# Altium schematic sheet OZ440-SE100-CAR003_sheet13.SchDoc
size A3
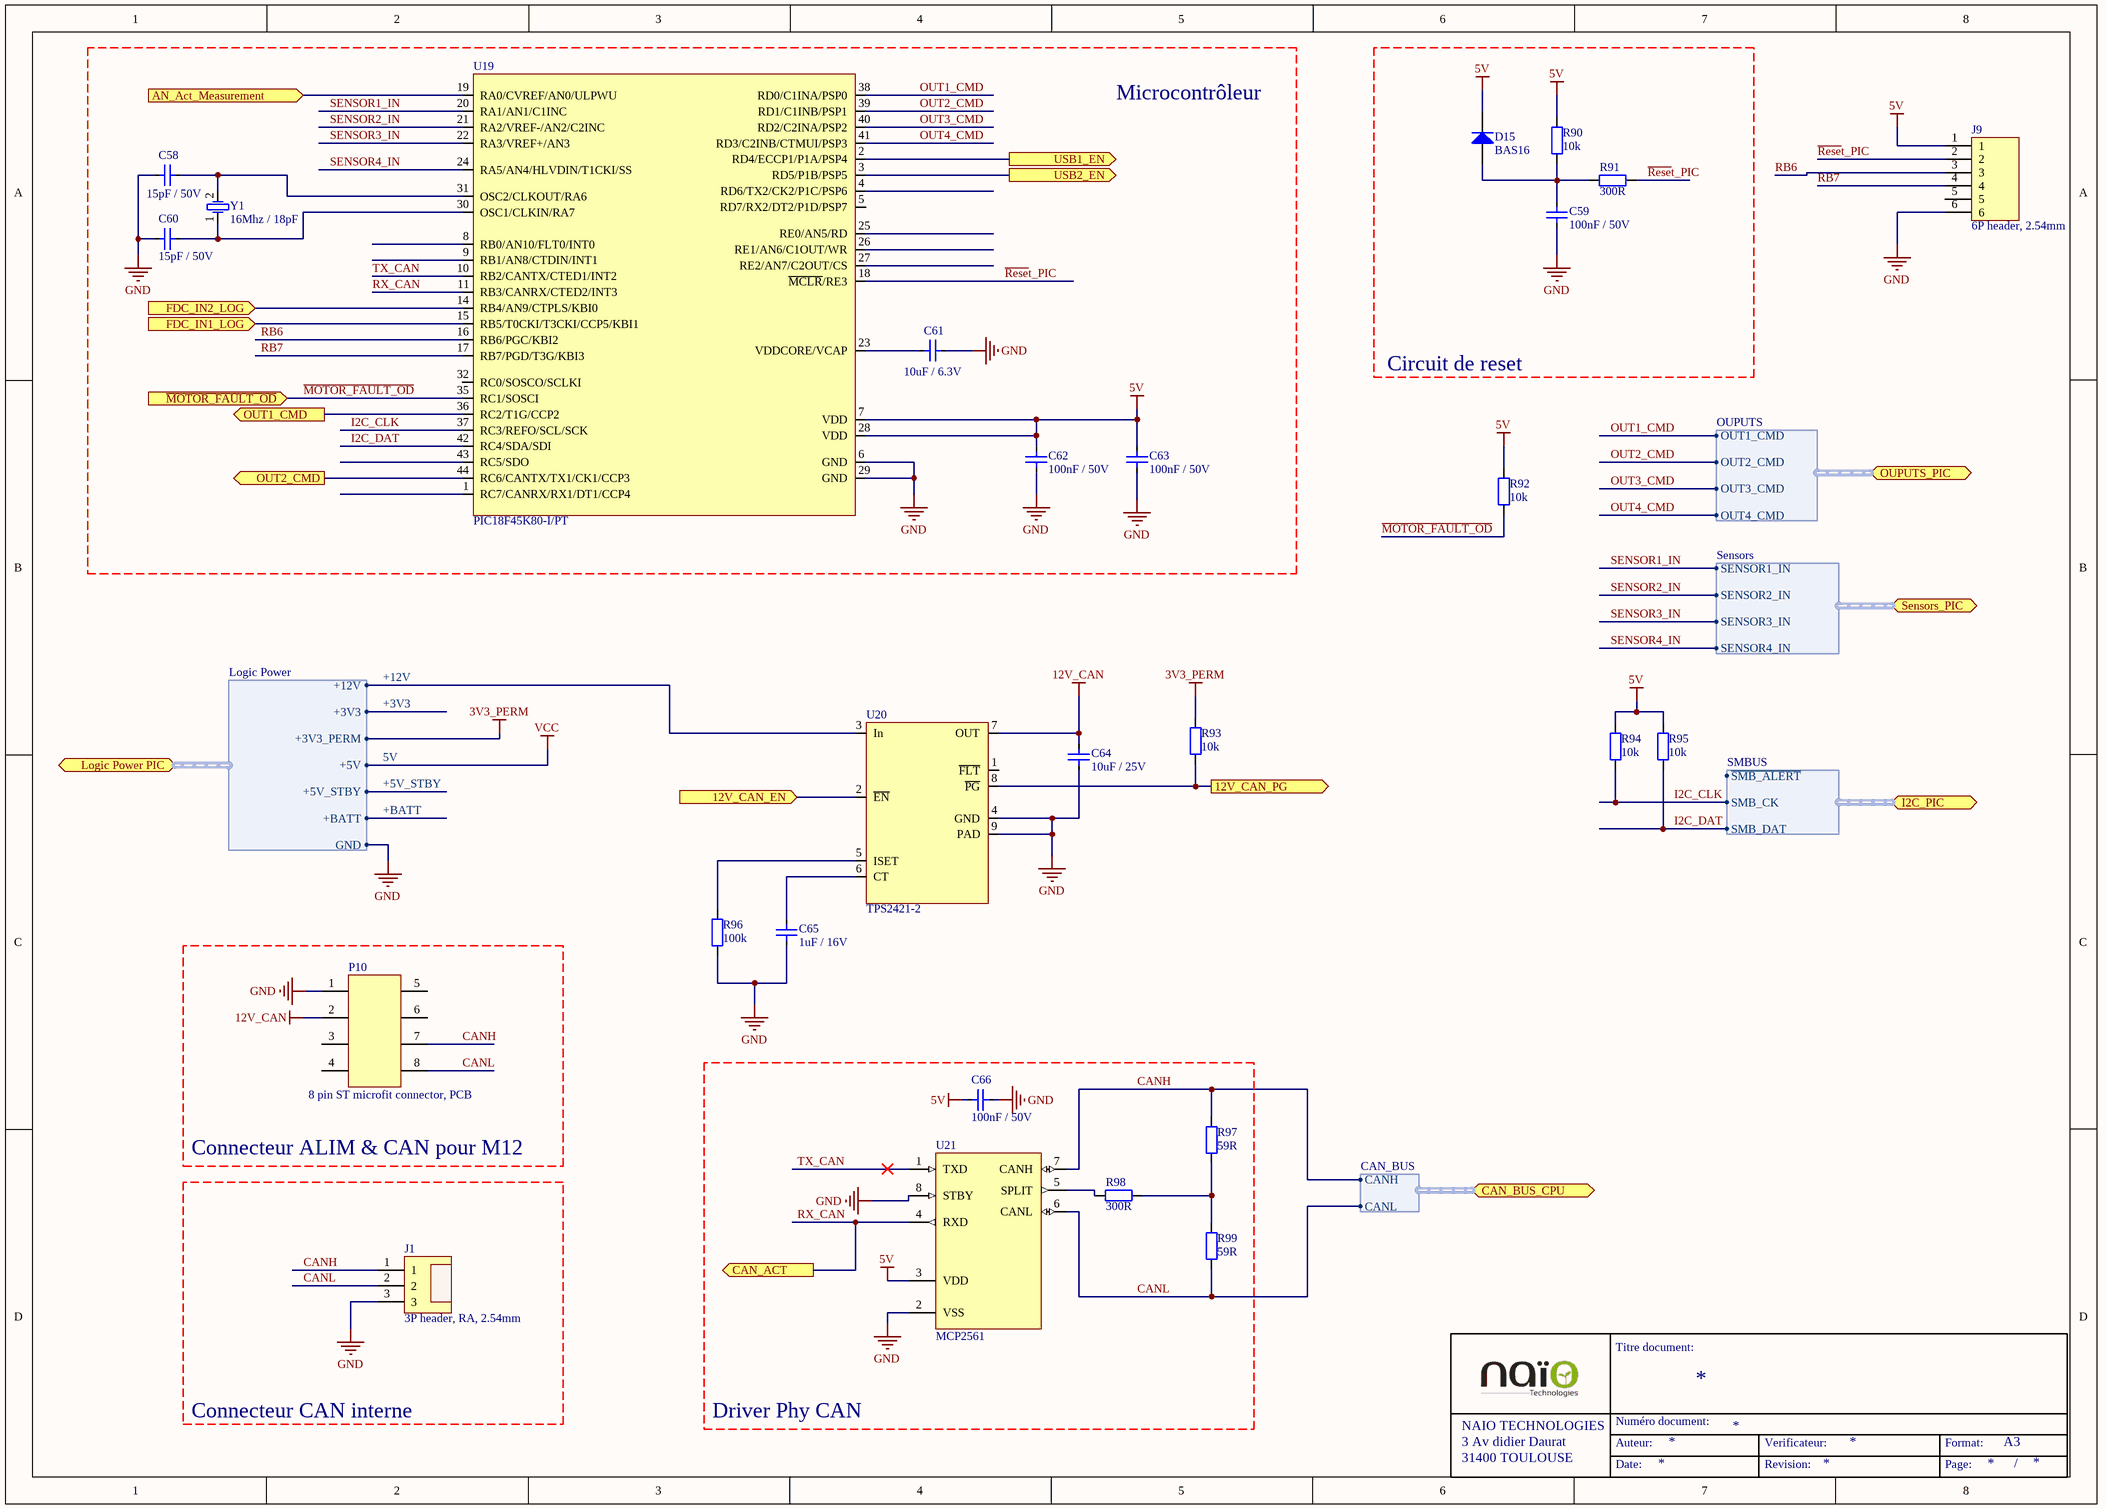
[diagram p0: OZ440-SE100-CAR003_sheet13.SchDoc]

## Parts
C58  Displayed reference: 15pF / 50V  [C0805-STD]  (hidden comment: CAP-SMD)
C59  Displayed reference: 100nF / 50V  [C0805-STD]  (hidden comment: CAP-SMD)
C60  Displayed reference: 15pF / 50V  [C0805-STD]  (hidden comment: CAP-SMD)
C61  Displayed reference: 10uF / 6.3V  [C0805-STD]  (hidden comment: CAP-SMD)
C62  Displayed reference: 100nF / 50V  [C0805-STD]  (hidden comment: CAP-SMD)
C63  Displayed reference: 100nF / 50V  [C0805-STD]  (hidden comment: CAP-SMD)
C64  Displayed reference: 10uF / 25V  [C1206-STD]  (hidden comment: CAP-SMD)
C65  Displayed reference: 1uF / 16V  [C0805-STD]  (hidden comment: CAP-SMD)
C66  Displayed reference: 100nF / 50V  [C0805-STD]  (hidden comment: CAP-SMD)
D15  Displayed reference: BAS16  [SOT23-STD]  (hidden comment: BAS16-SOT23)
J1  Displayed reference: 3P header, RA, 2.54mm  [CONN-SPE_MOLEX_0015913033]  (hidden comment: CONN-STD-3P_1ROW)
J9  Displayed reference: 6P header, 2.54mm  [6P_HEADER-STD_TH_1ROW]  (hidden comment: CONN-STD-6P_1ROW)
P10  Displayed reference: 8 pin ST microfit connector, PCB  [CONN-SPE_MOLEX_43045-0812]  (hidden comment: CONN-SPE-8P_MOLEX_43045-0801)
R90  Displayed reference: 10k  [R0805-STD]  (hidden comment: RES-SMD)
R91  Displayed reference: 300R  [R0805-STD]  (hidden comment: RES-SMD)
R92  Displayed reference: 10k  [R0805-STD]  (hidden comment: RES-SMD)
R93  Displayed reference: 10k  [R0805-STD]  (hidden comment: RES-SMD)
R94  Displayed reference: 10k  [R0805-STD]  (hidden comment: RES-SMD)
R95  Displayed reference: 10k  [R0805-STD]  (hidden comment: RES-SMD)
R96  Displayed reference: 100k  [R0805-STD]  (hidden comment: RES-SMD)
R97  Displayed reference: 59R  [R0805-STD]  (hidden comment: RES-SMD)
R98  Displayed reference: 300R  [R0805-STD]  (hidden comment: RES-SMD)
R99  Displayed reference: 59R  [R0805-STD]  (hidden comment: RES-SMD)
U19  Displayed reference: PIC18F45K80-I/PT  [TQFP44-SPE-PIC18F45k80]  (hidden comment: P18F45K80-TQFP44)
U20  Displayed reference: TPS2421-2  [SO8_THERMAL-STD]  (hidden comment: TPS2421-SO8)
U21  Displayed reference: MCP2561  [SO8-SPE-MCP2561]  (hidden comment: MCP2561-SOIC08)
Y1  Displayed reference: 16Mhz / 18pF  [XTAL-SPE-HC49_SMD]  (hidden comment: XTAL-SMD)

## Ports
12V_CAN_EN (in), 12V_CAN_PG (out), AN_Act_Measurement (in), CAN_ACT (out), CAN_BUS_CPU (harness CAN_BUS), FDC_IN1_LOG (in), FDC_IN2_LOG (in), I2C_PIC (harness SMBUS), Logic Power PIC (harness Logic Power), OUPUTS_PIC (harness OUPUTS), OUT1_CMD (out), OUT2_CMD (out), Sensors_PIC (harness Sensors), USB1_EN (out), USB2_EN (out), ~{MOTOR_FAULT_OD} (in)

## Harnesses
CAN_BUS: CANH, CANL
Logic Power: +12V, +3V3, +3V3_PERM, +5V, +5V_STBY, +BATT, GND
OUPUTS: OUT1_CMD, OUT2_CMD, OUT3_CMD, OUT4_CMD
Sensors: SENSOR1_IN, SENSOR2_IN, SENSOR3_IN, SENSOR4_IN
SMBUS: ~{SMB_ALERT}, SMB_CK, SMB_DAT

## Nets
3V3_PERM: R93.1 ; port Logic Power PIC.+3V3_PERM
5V: C62.2 C63.2 C66.2 D15.3(K) J9.1 R90.2 R92.2 R94.2 R95.2 U19.7(VDD) U19.28(VDD) U21.3(VDD) ; port Logic Power PIC.+5V  [also labelled VCC]
12V_CAN: C64.2 P10.2 U20.7(OUT)
GND: C58.1 C59.1 C60.1 C61.2 C62.1 C63.1 C64.1 C65.1 C66.1 J1.3 J9.6 P10.1 R96.1 U19.6(GND) U19.29(GND) U20.4(GND) U20.9(PAD) U21.2(VSS) U21.8(STBY) ; port Logic Power PIC.GND
12V_CAN_EN: U20.2(~{EN}) ; port 12V_CAN_EN
12V_CAN_PG: R93.2 U20.8(~{PG}) ; port 12V_CAN_PG
+3V3: port Logic Power PIC.+3V3
+5V_STBY: port Logic Power PIC.+5V_STBY
+12V: U20.3(In) ; port Logic Power PIC.+12V
+BATT: port Logic Power PIC.+BATT
~{MOTOR_FAULT_OD}: R92.1 U19.35(RC1/SOSCI) ; port ~{MOTOR_FAULT_OD}
~{Rese}t_PIC: J9.2 R91.2 U19.18(~{MCLR}/RE3)
AN_Act_Measurement: U19.19(RA0/CVREF/AN0/ULPWU) ; port AN_Act_Measurement
CANH: J1.1 P10.7 R97.2 U21.7(CANH) ; port CAN_BUS_CPU.CANH
CANL: J1.2 P10.8 R99.1 U21.6(CANL) ; port CAN_BUS_CPU.CANL
FDC_IN1_LOG: U19.15(RB5/T0CKI/T3CKI/CCP5/KBI1) ; port FDC_IN1_LOG
FDC_IN2_LOG: U19.14(RB4/AN9/CTPLS/KBI0) ; port FDC_IN2_LOG
I2C_CLK: R94.1 U19.37(RC3/REFO/SCL/SCK) ; port I2C_PIC.SMB_CK
I2C_DAT: R95.1 U19.42(RC4/SDA/SDI) ; port I2C_PIC.SMB_DAT
OUT1_CMD: U19.36(RC2/T1G/CCP2) ; port OUT1_CMD
OUT1_CMD: U19.38(RD0/C1INA/PSP0) ; port OUPUTS_PIC.OUT1_CMD  [a separate net that carries the same name]
OUT2_CMD: U19.44(RC6/CANTX/TX1/CK1/CCP3) ; port OUT2_CMD
OUT2_CMD: U19.39(RD1/C1INB/PSP1) ; port OUPUTS_PIC.OUT2_CMD  [a separate net that carries the same name]
OUT3_CMD: U19.40(RD2/C2INA/PSP2) ; port OUPUTS_PIC.OUT3_CMD
OUT4_CMD: U19.41(RD3/C2INB/CTMUI/PSP3) ; port OUPUTS_PIC.OUT4_CMD
RB6: J9.3 U19.16(RB6/PGC/KBI2)
RB7: J9.4 U19.17(RB7/PGD/T3G/KBI3)
RX_CAN: U19.11(RB3/CANRX/CTED2/INT3) U21.4(RXD) ; port CAN_ACT
SENSOR1_IN: U19.20(RA1/AN1/C1INC) ; port Sensors_PIC.SENSOR1_IN
SENSOR2_IN: U19.21(RA2/VREF-/AN2/C2INC) ; port Sensors_PIC.SENSOR2_IN
SENSOR3_IN: U19.22(RA3/VREF+/AN3) ; port Sensors_PIC.SENSOR3_IN
SENSOR4_IN: U19.24(RA5/AN4/HLVDIN/T1CKI/SS) ; port Sensors_PIC.SENSOR4_IN
TX_CAN: U19.10(RB2/CANTX/CTED1/INT2) U21.1(TXD)
USB1_EN: U19.2(RD4/ECCP1/P1A/PSP4) ; port USB1_EN
USB2_EN: U19.3(RD5/P1B/PSP5) ; port USB2_EN
NetC58_2: C58.2 U19.31(OSC2/CLKOUT/RA6) Y1.2(OSC2)
NetC59_2: C59.2 D15.1(A) R90.1 R91.1
NetC60_2: C60.2 U19.30(OSC1/CLKIN/RA7) Y1.1(OSC1)
NetC61_1: C61.1 U19.23(VDDCORE/VCAP)
NetC65_2: C65.2 U20.6(CT)
NetR96_2: R96.2 U20.5(ISET)
NetR97_1: R97.1 R98.2 R99.2
NetR98_1: R98.1 U21.5(SPLIT)

Not connected (* = marked no-connect by the designer): J9 5; P10 3 4(7) 5(9) 6; U19 1(RC7/CANRX/RX1/DT1/CCP4) 4(RD6/TX2/CK2/P1C/PSP6) 5(RD7/RX2/DT2/P1D/PSP7) 8(RB0/AN10/FLT0/INT0) 9(RB1/AN8/CTDIN/INT1) 25(RE0/AN5/RD) 26(RE1/AN6/C1OUT/WR) 27(RE2/AN7/C2OUT/CS) 32(RC0/SOSCO/SCLKI) 43(RC5/SDO); U20 1(~{FLT})

## Notes on the sheet
- Microcontrôleur
- Circuit de reset
- Connecteur ALIM & CAN pour M12
- Connecteur CAN interne
- Driver Phy CAN
- Titre document:
- NAIO TECHNOLOGIES
- 3 Av didier Daurat
- 31400 TOULOUSE
- Auteur:
- Numéro document:
- Verificateur:
- Format:
- A3
- Date:
- Revision:
- Page:
- /

## Library data of the parts
C58 C60 = C0805C150J5GACxx: 0805 15pF / 50V COG ceramic capacitor; Manufacturer: Kemet; Max Voltage: 50; Tolerance: +/- 5%; Validated: N; Reference: C0805C150J5GACxx; Value: 15pF; Material: COG; Footprint description: standard Capacitor 0805; Pin Count: 2; helpURL: http://www.farnell.com/datasheets/40863.pdf; Supplier 1: Farnell; Supplier Part Number 1: 1650868; Supplier 2: Digi-Key; Supplier Part Number 2: 399-1111-1-ND
C59 C62 C63 C66 = VJ0805Y104KXAxx: 0805 100nF / 50V  X7R ceramic capacitor; Manufacturer: vishay; Max Voltage: 50; Tolerance: +/- 10%; Validated: N; Reference: VJ0805Y104KXAxx; Value: 100nF; Material: X7R; Footprint description: standard Capacitor 0805; Pin Count: 2; helpURL: http://www.vishay.com/docs/45200/highrels.pdf; Supplier 1: Farnell; Supplier Part Number 1: 1612208; Supplier 2: Digi-Key; Supplier Part Number 2: 720-1266-6-ND
C61 = C0805C106K9PACxx: 0805 10uF / 6.3V X5R ceramic capacitor; Manufacturer: Kemet; Max Voltage: 6.3; Tolerance: +/- 10%; Validated: N; Reference: C0805C106K9PACxx; Value: 10uF; Material: X5R; Footprint description: standard Capacitor 0805; Pin Count: 2; helpURL: http://www.farnell.com/datasheets/40863.pdf; Supplier 1: Farnell; Supplier Part Number 1: 1643357; Supplier 2: Digi-Key; Supplier Part Number 2: 399-3138-1-ND
C64 = C1206C106K3RACxx: 1206 10uF / 25V X7R ceramic capacitor; Manufacturer: Kemet; Max Voltage: 25; Tolerance: +/- 10%; Validated: N; Reference: C1206C106K3RACxx; Value: 10uF; Material: X7R; Footprint description: standard Capacitor 1206; Pin Count: 2; helpURL: http://www.farnell.com/datasheets/1444528.pdf; Supplier 1: Farnell; Supplier Part Number 1: 2118134; Supplier 2: Digi-Key; Supplier Part Number 2: 399-7442-1-ND
C65 = C0805C105K4RACxx: 0805 1uF / 16V X7R ceramic capacitor; Manufacturer: Kemet; Max Voltage: 16; Tolerance: +/- 10%; Validated: N; Reference: C0805C105K4RACxx; Value: 1uF; Material: X7R; Footprint description: standard Capacitor 0805; Pin Count: 2; helpURL: http://www.farnell.com/datasheets/40863.pdf; Supplier 1: Farnell; Supplier Part Number 1: 9227792; Supplier 2: Digi-Key; Supplier Part Number 2: 399-6930-1-ND
D15 = BAS16: 100V / 120mA signal  diode; Manufacturer: NXP; Max Voltage: 100; Max Current: 0.2A; Validated: False; Reference: BAS16; component type: DIODE; Footprint description: Sot23 SMD package; Pin Count: 3; Rev: 2010; helpURL: http://www.nxp.com/documents/data_sheet/BAS16_SER.pdf; Supplier 1: Farnell; Supplier Part Number 1: 1081180; Supplier 2: Digi-Key; Supplier Part Number 2: 568-1596-1-ND
J1 = 0015913033: 3 pin , 2.54mm SMD header; Manufacturer: Molex; Validated: False; Reference: 0015913033; Footprint description: 3P header, RA, 2.54mm; Pin Count: 3; Rev: G; helpURL: http://www.molex.com/pdm_docs/sd/015913033_sd.pdf; Supplier 1: Mouser; Supplier Part Number 1: 538-15-91-3033; Supplier 2: Digi-Key; Supplier Part Number 2: 0015913033-ND
J9 = 68000-406HLF: 6P, 1 row, 2.54mm header; Manufacturer: FCI; Validated: False; Reference: 68000-406HLF; Footprint description: TH, 6 pin, 2.54mm; Pin Count: 6; Rev: DB; helpURL: http://portal.fciconnect.com/Comergent//fci/drawing/68000.pdf
P10 = 43045-0812: 8 pin Microfit connector; Manufacturer: Molex; Max Voltage: 600V; Max Current: 5A; Reference: 43045-0812; Footprint description: 8 pin SMT connector ST, TH; Rev: G; helpURL: http://www.molex.com/pdm_docs/sd/430450812_sd.pdf
R90 R92-R95 = CRCW080510K0FKxx: 10k Ohm 0805 SMD resistor; Manufacturer: Vishay; Value: 10 000; Tolerance: 1 %; Rated Power: 0,125 W; Validated: No; Reference: CRCW080510K0FKxx; Footprint description: standard 0805 SMD; Pin Count: 2; helpURL: http://www.vishay.com/docs/20035/dcrcwe3.pdf; Supplier 1: Farnell; Supplier Part Number 1: 1469856; Supplier 2: Mouser; Supplier Part Number 2: 71-CRCW0805-10K-E3
R91 R98 = CRCW0805300RFKxx: 300 ohm 0805 SMD resistor; Manufacturer: Vishay; Value: 300; Tolerance: 1%; Rated Power: 0.125W; Validated: No; Reference: CRCW0805300RFKxx; Footprint description: standard 0805 SMD; Pin Count: 2; helpURL: http://www.vishay.com/docs/20035/dcrcwe3.pdf; Supplier 1: Mouser; Supplier Part Number 1: 71-CRCW0805300RFKEA; Supplier 2: Farnell; Supplier Part Number 2: 1152346
R96 = CRCW0805100KFKxx: 100k Ohm 0805 SMD resistor; Manufacturer: Vishay; Value: 100 000; Tolerance: 1 %; Rated Power: 0,125 W; Validated: No; Reference: CRCW0805100KFKxx; Footprint description: standard 0805 SMD; Pin Count: 2; helpURL: http://www.vishay.com/docs/20035/dcrcwe3.pdf; Supplier 1: Farnell; Supplier Part Number 1: 1469860; Supplier 2: Mouser; Supplier Part Number 2: 71-CRCW0805-100K-E3
R97 R99 = CRCW080559R0FKxx: 59 Ohm 0805 SMD resistor; Manufacturer: Vishay; Value: 59; Tolerance: 1 %; Rated Power: 0.125 W; Validated: No; Reference: CRCW080559R0FKxx; Footprint description: standard 0805 SMD; Pin Count: 2; helpURL: http://www.vishay.com/docs/20035/dcrcwe3.pdf; Supplier 1: Mouser; Supplier Part Number 1: 71-CRCW080559R0FKEA; Supplier 2: Farnell; Supplier Part Number 2: 2138817
U19 = PIC18F45K80-I/PT: Pic microcontroller with embeded CAN controller; Manufacturer: MICROCHIP; Validated: False; Reference: PIC18F45K80-I/PT; Footprint description: standard TQFP 44 pin; Pin Count: 44; Rev: F; helpURL: http://ww1.microchip.com/downloads/en/DeviceDoc/39977f.pdf; Supplier 1: Farnell; Supplier Part Number 1: 1823169; Supplier 2: Mouser; Supplier Part Number 2: 579-PIC18F45K80-I/PT
U20 = TPS2421-2DDA: 20V-5A Hot plug controller with integrated FET, auto retry; Manufacturer: TI; Max Voltage: 20V; Max Current: 5A; Validated: False; Reference: TPS2421-2DDA; Footprint description: SO8 with thermal PAD; Pin Count: 8; Rev: 01/14; helpURL: http://www.ti.com/lit/ds/symlink/tps2421-1.pdf; Supplier 1: Mouser; Supplier Part Number 1: 595-TPS2421-2DDA; Supplier 2: Farnell; Supplier Part Number 2: 2323674
U21 = MCP2561-E/SN: CAN transceiver with common mode stabilisation; Manufacturer: Microchip; Max Voltage: 5.5V; Validated: False; Reference: MCP2561-E/SN; Footprint description: standard SO8; Pin Count: 8; Rev: B; helpURL: http://ww1.microchip.com/downloads/en/DeviceDoc/25167B.pdf; Supplier 1: Farnell; Supplier Part Number 1: 2362837; Supplier 2: Mouser; Supplier Part Number 2: 579-MCP2561-E/SN
Y1 = ABLS2-16.000MHZ-D4Y-T: 16Mhz Crystal / low profile 3.3mm; Manufacturer: Abracon; Value: 16 000; Validated: False; Reference: ABLS2-16.000MHZ-D4Y-T; Footprint description: HC49 Low_profile; Pin Count: 2; Frequency band: 16Mhz; helpURL: http://www.farnell.com/datasheets/1749648.pdf; Supplier 1: Farnell; Supplier Part Number 1: 1885210; Supplier 2: Mouser; Supplier Part Number 2: 815-ABLS2-16-D4Y-T